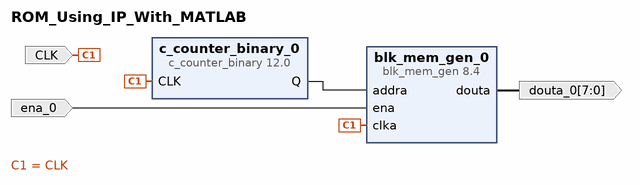
[diagram p0: block diagram of the top level]
# Vivado block design ROM_Using_IP_With_MATLAB, xc7a100tcsg324-1, Vivado 2018.2
create_bd_design ROM_Using_IP_With_MATLAB

create_bd_port -dir I -type clk CLK
set_property -dict {CONFIG.FREQ_HZ 10000000} [get_bd_ports CLK]
create_bd_port -dir O -from 7 -to 0 douta_0
create_bd_port -dir I ena_0

create_bd_cell -type ip -vlnv xilinx.com:ip:blk_mem_gen:8.4 blk_mem_gen_0
set_property -dict [list \
  CONFIG.Memory_Type Single_Port_ROM \
  CONFIG.Enable_32bit_Address false \
  CONFIG.Write_Width_A 8 \
  CONFIG.Write_Depth_A 1024 \
  CONFIG.Register_PortA_Output_of_Memory_Primitives true \
  CONFIG.Load_Init_File true \
  CONFIG.Coe_File ../../../../../../Matlab_Files/Updated_Coe_File.coe \
  CONFIG.Use_RSTA_Pin false \
  CONFIG.Port_A_Write_Rate 0 \
  CONFIG.use_bram_block Stand_Alone \
] [get_bd_cells blk_mem_gen_0]
create_bd_cell -type ip -vlnv xilinx.com:ip:c_counter_binary:12.0 c_counter_binary_0
set_property -dict {CONFIG.Output_Width 10} [get_bd_cells c_counter_binary_0]

# ---- connections ----

connect_bd_net [get_bd_pins c_counter_binary_0/Q] [get_bd_pins blk_mem_gen_0/addra]
connect_bd_net -net CLK_0_1 [get_bd_ports CLK] [get_bd_pins c_counter_binary_0/CLK] [get_bd_pins blk_mem_gen_0/clka]
connect_bd_net [get_bd_pins blk_mem_gen_0/douta] [get_bd_ports douta_0]
connect_bd_net -net ena_0_1 [get_bd_ports ena_0] [get_bd_pins blk_mem_gen_0/ena]

validate_bd_design
save_bd_design
